# EAGLE design Monlock5x7_buffered (EAGLE 7.2.0)
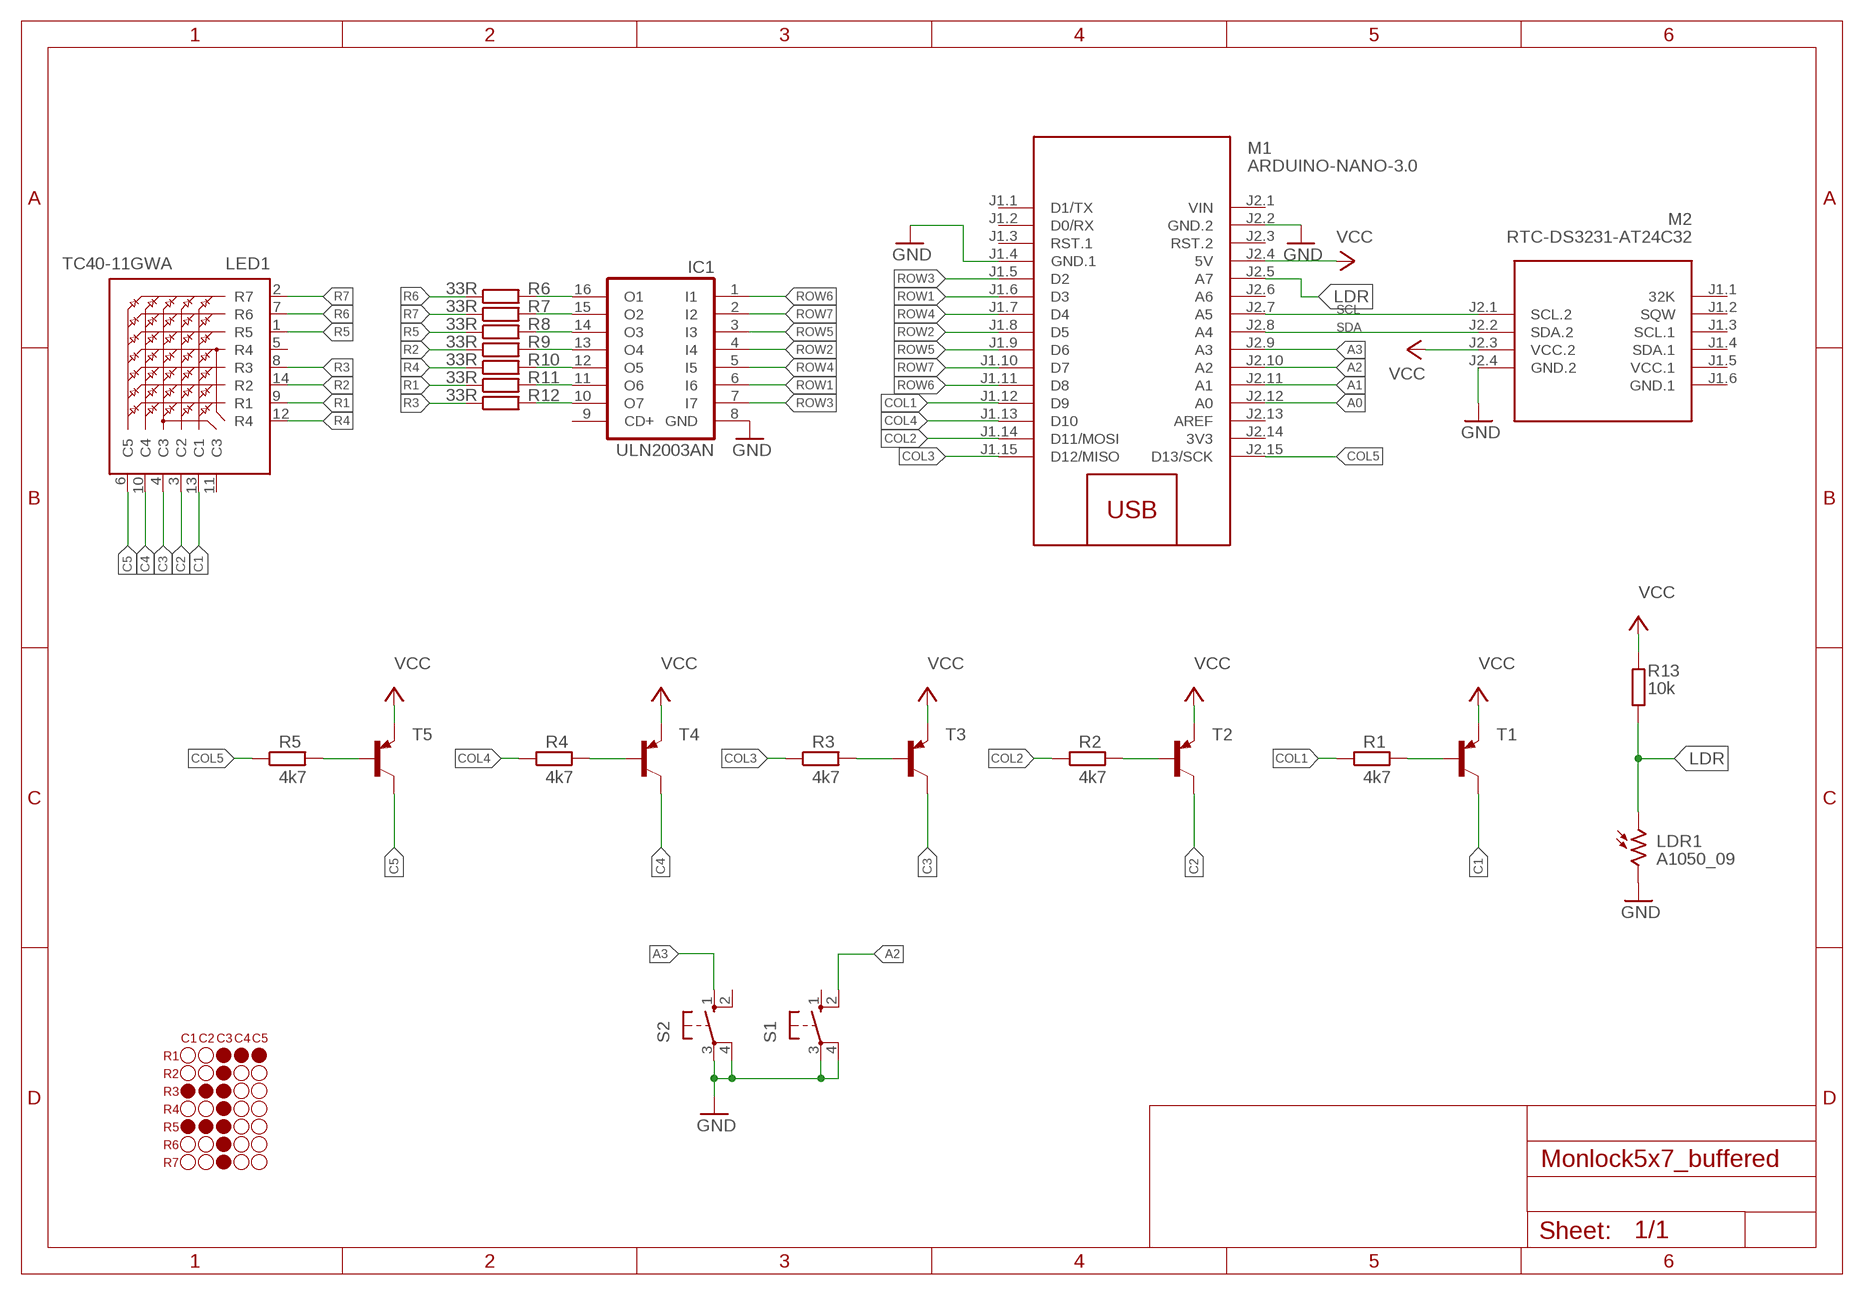
[diagram p0: schematic, sheet 1]

## Parts
IC1  ULN2003AN  [DIL16]
LDR1  A1050_09  [T0-46-A10XX]
LED1  TC40-11GWA  [TC40-11GWA]
M1  ARDUINO-NANO-3.0  [ARDUINO-NANO-3.0]
M2  RTC-DS3231-AT24C32  [RTC-DS3231-AT24C32]
R1  4k7  R-EU_0204/7  [0204/7]
R2  4k7  R-EU_0204/7  [0204/7]
R3  4k7  R-EU_0204/7  [0204/7]
R4  4k7  R-EU_0204/7  [0204/7]
R5  4k7  R-EU_0204/7  [0204/7]
R6  33R  R-EU_0204/7  [0204/7]
R7  33R  R-EU_0204/7  [0204/7]
R8  33R  R-EU_0204/7  [0204/7]
R9  33R  R-EU_0204/7  [0204/7]
R10  33R  R-EU_0204/7  [0204/7]
R11  33R  R-EU_0204/7  [0204/7]
R12  33R  R-EU_0204/7  [0204/7]
R13  10k  R-EU_0204/7  [0204/7]
S1  40-XX  [B3F-40XX]
S2  40-XX  [B3F-40XX]
T1  BC327-PNP-TO92-EBC  [TO92-EBC]
T2  BC327-PNP-TO92-EBC  [TO92-EBC]
T3  BC327-PNP-TO92-EBC  [TO92-EBC]
T4  BC327-PNP-TO92-EBC  [TO92-EBC]
T5  BC327-PNP-TO92-EBC  [TO92-EBC]

## Nets
A0: M1.J2.12(A0)
A1: M1.J2.11(A1)
A2: M1.J2.10(A2) S1.2(S1)
A3: M1.J2.9(A3) S2.1(S)
C1: LED1.13(C1) T1.C
C2: LED1.3(C2) T2.C
C3: LED1.4(C3) T3.C
C4: LED1.10(C4) T4.C
C5: LED1.6(C5) T5.C
CC1: R1.2 T1.B
CC2: R2.2 T2.B
CC3: R3.2 T3.B
CC4: R4.2 T4.B
CC5: R5.2 T5.B
COL1: M1.J1.12(D9) R1.1
COL2: M1.J1.14(D11/MOSI) R2.1
COL3: M1.J1.15(D12/MISO) R3.1
COL4: M1.J1.13(D10) R4.1
COL5: M1.J2.15(D13/SCK) R5.1
GND: IC1.8(GND) LDR1.2 M1.J1.4(GND.1) M1.J2.2(GND.2) M2.J2.4(GND.2) S1.3(P) S1.4(P1) S2.3(P) S2.4(P1)
LDR: LDR1.1 M1.J2.5(A7) R13.1
N$6: IC1.16(O1) R6.2
N$7: IC1.15(O2) R7.2
N$8: IC1.14(O3) R8.2
N$11: IC1.13(O4) R9.2
N$12: IC1.12(O5) R10.2
N$14: IC1.11(O6) R11.2
N$15: IC1.10(O7) R12.2
R1: LED1.9(R1) R11.1
R2: LED1.14(R2) R9.1
R3: LED1.8(R3) R12.1
R4: LED1.12(R4) R10.1
R5: LED1.1(R5) R8.1
R6: LED1.7(R6) R6.1
R7: LED1.2(R7) R7.1
ROW1: IC1.6(I6) M1.J1.6(D3)
ROW2: IC1.4(I4) M1.J1.8(D5)
ROW3: IC1.7(I7) M1.J1.5(D2)
ROW4: IC1.5(I5) M1.J1.7(D4)
ROW5: IC1.3(I3) M1.J1.9(D6)
ROW6: IC1.1(I1) M1.J1.11(D8)
ROW7: IC1.2(I2) M1.J1.10(D7)
SCL: M1.J2.7(A5) M2.J2.1(SCL.2)
SDA: M1.J2.8(A4) M2.J2.2(SDA.2)
VCC: M1.J2.4(5V) M2.J2.3(VCC.2) R13.2 T1.E T2.E T3.E T4.E T5.E
Unconnected: IC1.9(CD+) LED1.5(R4) LED1.11(C3) M1.J1.1(D1/TX) M1.J1.2(D0/RX) M1.J1.3(RST.1) M1.J2.3(RST.2) M1.J2.6(A6) M1.J2.13(AREF) M2.J1.1(32K) M2.J1.2(SQW) M2.J1.3(SCL.1) M2.J1.4(SDA.1) S1.1(S) S2.2(S1)

## Notes on the sheet
- C1 | C2 | C3 | C4 | C5
- R1
- R2
- R3
- R4
- R5
- R6
- R7

## Power pins joined to a net without a drawn wire
3V3: M1.J2.14(3V3)
GND: M2.J1.6(GND.1)
VCC.1: M2.J1.5(VCC.1)
VIN: M1.J2.1(VIN)

## Library data of the parts
IC1 = uln-udn:ULN2003A: DRIVER ARRAY
LDR1 = photo-elements:A10: Sensor Robust Light Sensing Applications Outdoor Light Sensing Application Source: http://optoelectronics.perkinelmer.com/content/Datasheets/DTS_PhotocellsA1050.pdf
LED1 = display-5x7-4inch:TC40-11GWA: 100mm (4.0 INCH) 5x7 DOT MATRIX DISPLAY https://www.kingbrightusa.com/images/catalog/SPEC/TC40-11GWA.pdf; OC_FARNELL: unknown; OC_NEWARK: unknown
M1 = diy-modules:ARDUINO-NANO-3.0: Arduino Nano 3.0 and compatible devices More details available here: https://www.arduino.cc/en/Main/ArduinoBoardNano Click here to find device on ebay.com <http://www.ebay.com/sch/arduino+nano>
M2 = diy-modules:RTC-DS3231-AT24C32: RTC Module with Battery and EEPROM based on DS3231 and AT24C32 chips Tutorial can be found here: https://edwardmallon.wordpress.com/2014/05/21/using-a-cheap-3-ds3231-rtc-at24c32-eeprom-from-ebay/ Click here to find device on ebay.com <http://www.ebay.com/sch/DS3231+AT24C32+module>
R1-R13 = rcl:R-EU_: RESISTOR, European symbol
S1 S2 = switch-omron:40-XX: OMRON SWITCH; MF: OMRON COMPONENTS USA; MPN: B3F-4000; OC_FARNELL: 176434; OC_NEWARK: 36K3105
T1-T5 = transistor:*-PNP-: PNP Transistror

## Board
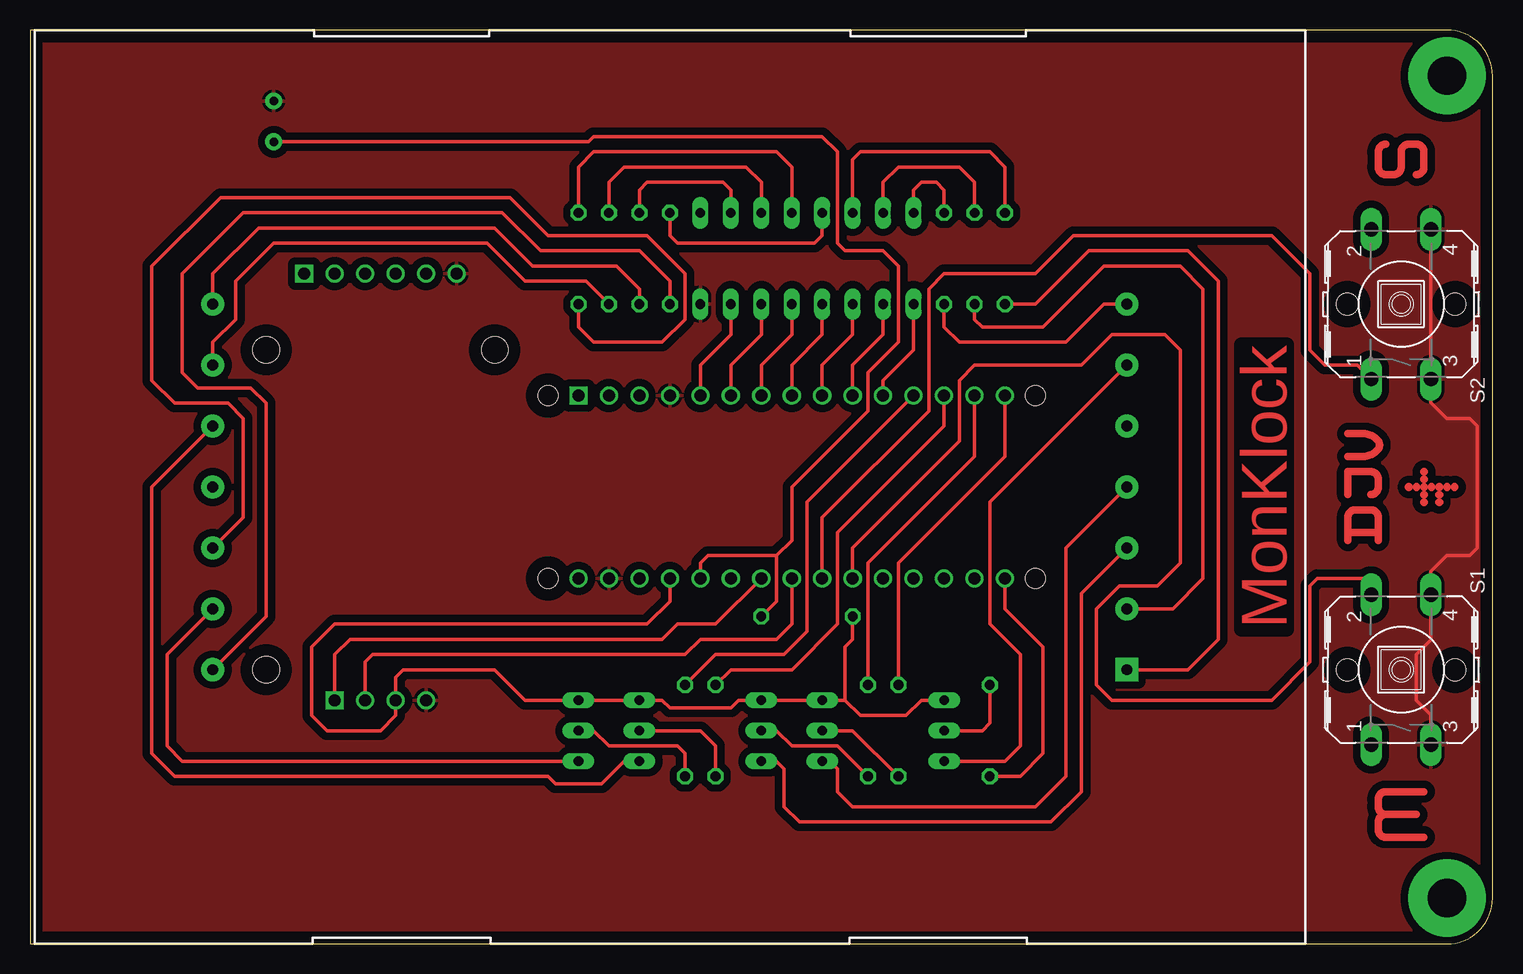
[diagram p1: board, top side]
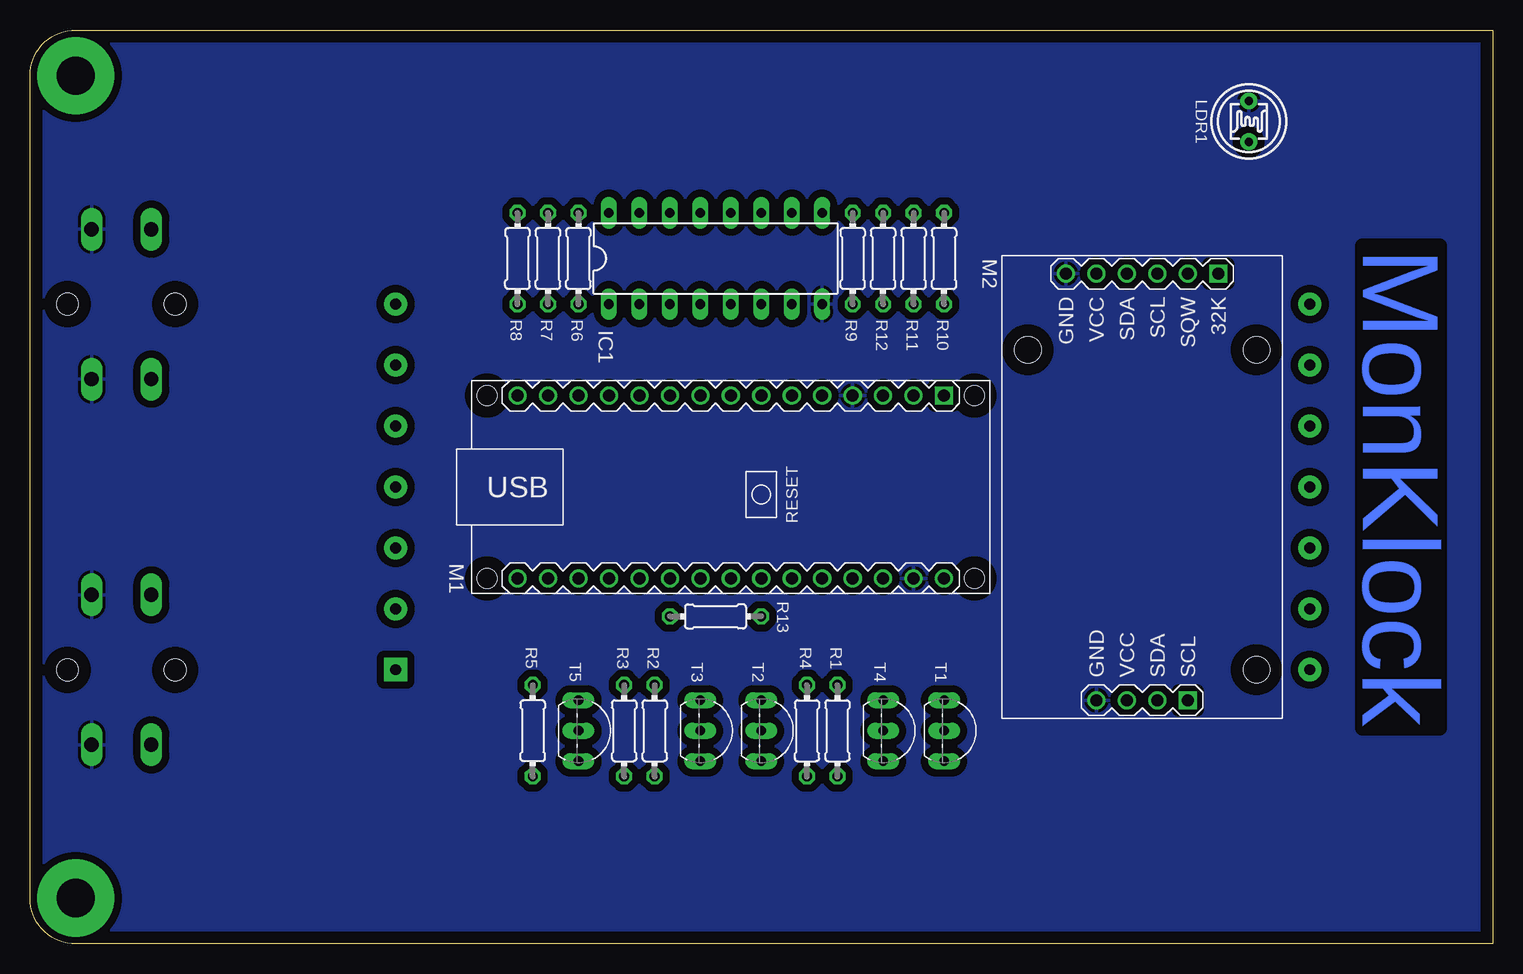
[diagram p2: board, bottom side, seen from below]

Size 121.92 x 76.2 mm. Coordinates in mm from the lower left corner, seen from the top.
Outline: 0,0 118.11,0 arc90 121.92,3.81 121.92,72.39 arc90 118.11,76.2 0,76.2 0,0
Copper layers (1*16): Top 0.035mm / dielectric 1.5mm / Bottom 0.035mm
Design rules "default *": minimum track width 10mil, minimum drill 24mil, track to track 8mil, track to pad 8mil, pad to pad 8mil, via to via 8mil, smd to smd 8mil, copper to edge 40mil, drill to drill 8mil, minimum pad ring 10mil, minimum via ring 8mil, stop-mask expansion 4mil, vias tented up to drill 0mil, thermal gap 10mil

### Footprints (pad centres in the part's own frame; a part is rotated, then mirrored left to right if it is on the bottom)
DIL16 = drill 0.813 long: 1 -8.89,-3.81; 2 -6.35,-3.81; 3 -3.81,-3.81; 4 -1.27,-3.81; 5 1.27,-3.81; 6 3.81,-3.81; 7 6.35,-3.81; 8 8.89,-3.81; 9 8.89,3.81; 10 6.35,3.81; 11 3.81,3.81; 12 1.27,3.81; 13 -1.27,3.81; 14 -3.81,3.81; 15 -6.35,3.81; 16 -8.89,3.81
T0-46-A10XX = drill 0.7 pad 1.4: 1 -1.7,0; 2 1.7,0
TC40-11GWA = drill 0.9 pad 1.93 square: 1 -15.24,-38.1 | drill 0.9 pad 1.93: 2 -10.16,-38.1; 3 -5.08,-38.1; 4 0,-38.1; 5 5.08,-38.1; 6 10.16,-38.1; 7 15.24,-38.1; 8 15.24,38.1; 9 10.16,38.1; 10 5.08,38.1; 11 0,38.1; 12 -5.08,38.1; 13 -10.16,38.1; 14 -15.24,38.1
ARDUINO-NANO-3.0 = drill 1 square: J1.1 17.78,7.62 | drill 1: J1.2 15.24,7.62; J1.3 12.7,7.62; J1.4 10.16,7.62; J1.5 7.62,7.62; J1.6 5.08,7.62; J1.7 2.54,7.62; J1.8 0,7.62; J1.9 -2.54,7.62; J1.10 -5.08,7.62; J1.11 -7.62,7.62; J1.12 -10.16,7.62; J1.13 -12.7,7.62; J1.14 -15.24,7.62; J1.15 -17.78,7.62; J2.1 17.78,-7.62; J2.2 15.24,-7.62; J2.3 12.7,-7.62; J2.4 10.16,-7.62; J2.5 7.62,-7.62; J2.6 5.08,-7.62; J2.7 2.54,-7.62; J2.8 0,-7.62; J2.9 -2.54,-7.62; J2.10 -5.08,-7.62; J2.11 -7.62,-7.62; J2.12 -10.16,-7.62; J2.13 -12.7,-7.62; J2.14 -15.24,-7.62; J2.15 -17.78,-7.62 | hole 1.651: -20.32,7.62; -20.32,-7.62; 20.32,-7.62; 20.32,7.62
RTC-DS3231-AT24C32 = drill 1 square: J1.1 -17.78,6.35; J2.1 17.78,3.81 | drill 1: J1.2 -17.78,3.81; J1.3 -17.78,1.27; J1.4 -17.78,-1.27; J1.5 -17.78,-3.81; J1.6 -17.78,-6.35; J2.2 17.78,1.27; J2.3 17.78,-1.27; J2.4 17.78,-3.81 | hole 2.2: -11.43,-9.525; -11.43,9.525; 15.24,9.525
0204/7 = drill 0.813 octagon: 1 -3.81,0; 2 3.81,0
B3F-40XX = drill 1.194 long: 1 -6.248,2.489; 2 6.248,2.489; 3 -6.248,-2.489; 4 6.248,-2.489 | hole 1.803: 0,-4.496; 0,4.496
TO92-EBC = drill 0.813 long: B 0,-1.27; C 2.54,-1.27; E -2.54,-1.27

### Placement (x,y rotation side)
IC1  64.77,57.15 0 bottom
LDR1  20.32,68.58 90 bottom
LED1  53.34,38.1 90 top
M1  63.5,38.1 0 bottom
M2  29.21,38.1 270 bottom
R1  54.61,17.78 270 bottom
R2  69.85,17.78 270 bottom
R3  72.39,17.78 270 bottom
R4  57.15,17.78 270 bottom
R5  80.01,17.78 90 bottom
R6  76.2,57.15 90 bottom
R7  78.74,57.15 90 bottom
R8  81.28,57.15 90 bottom
R9  53.34,57.15 90 bottom
R10  45.72,57.15 90 bottom
R11  48.26,57.15 90 bottom
R12  50.8,57.15 90 bottom
R13  64.77,27.3 180 bottom
S1  114.3,22.86 90 top
S2  114.3,53.34 90 top
T1  44.45,17.78 270 bottom
T2  59.69,17.78 270 bottom
T3  64.77,17.78 270 bottom
T4  49.53,17.78 270 bottom
T5  74.93,17.78 270 bottom

### Tracks (layer width: path | path; a pad name or v marks a point on that pad's centre or on a via)
A2
  Top 0.305: M1.J2.10 68.58,33.02 77.47,41.91 77.47,46.99 78.74,48.26 87.63,48.26 90.17,50.8 94.61,50.8 95.88,49.53 95.88,31.75 93.98,29.84 90.8,29.84 88.9,27.94 88.9,21.59 90.17,20.32 103.5,20.32 106.68,23.5 106.68,29.84 107.31,30.48 111.12,30.48 111.81,29.79 S1.2
A3
  Top 0.305: M1.J2.9 66.04,35.56 74.93,44.45 74.93,54.61 76.2,55.88 83.82,55.88 86.99,59.05 103.5,59.05 106.68,55.88 106.68,49.53 107.95,48.26 110.64,48.26 S2.1
C1
  Top 0.305: LED1.13 11.43,24.13 11.43,16.51 12.7,15.24 T1.C
C2
  Top 0.305: T2.C 62.23,15.24 62.87,14.61 62.87,11.43 64.14,10.16 85.09,10.16 87.63,12.7 87.63,29.21 LED1.3
C3
  Top 0.305: LED1.4 86.36,33.02 86.36,13.97 83.82,11.43 69.85,11.43 68.58,11.43 67.31,12.7 67.31,14.61 66.67,15.24 T3.C
C4
  Top 0.305: T4.C 49.53,15.24 47.62,13.34 43.81,13.34 43.18,13.97 12.07,13.97 10.16,15.88 10.16,38.1 LED1.10
C5
  Top 0.305: LED1.6 80.01,36.83 80.01,26.67 82.55,24.13 82.55,16.51 81.28,15.24 T5.C
CC1
  Top 0.305: T1.B 46.99,17.78 48.26,16.51 53.98,16.51 54.61,15.88 R1.2
CC2
  Top 0.305: T2.B 62.23,17.78 63.5,16.51 67.31,16.51 R2.2
CC3
  Top 0.305: T3.B 68.58,17.78 R3.2
CC4
  Top 0.305: T4.B 55.88,17.78 57.15,16.51 R4.2
CC5
  Top 0.305: T5.B 79.38,17.78 80.01,18.41 R5.2
COL1
  Top 0.305: M1.J1.12 64.77,36.83 64.77,26.04 62.87,24.13 57.15,24.13 R1.1
COL2
  Top 0.305: R2.1 69.85,31.75 78.74,40.64 M1.J1.14
COL3
  Top 0.305: R3.1 72.39,31.75 81.28,40.64 M1.J1.15
COL4
  Top 0.305: M1.J1.13 76.2,43.18 67.31,34.29 67.31,26.67 63.5,22.86 58.42,22.86 R4.1
COL5
  Top 0.305: M1.J2.15 81.28,27.94 83.82,25.4 84.45,24.77 84.45,15.88 82.55,13.97 R5.1
GND
  Top 0.305: S1.3 116.79,19.1 115.57,20.32 115.57,24.13 116.79,25.35 S1.4 116.79,31.06 118.11,32.38 120.02,32.38 120.65,33.02 120.65,43.18 120.02,43.81 118.11,43.81 116.79,45.14 S2.3 S2.4
  pour Top (isolate 0.61): 0,0 0,76.2 122.55,76.2 122.55,0
  pour Bottom (isolate 0.61): 0,0 0,76.2 121.92,76.2 121.92,0
LDR
  Top 0.305: R13.1 62.23,28.57 62.23,32.38 | 62.23,32.38 56.52,32.38 55.88,31.75 M1.J2.5 | 62.23,32.38 63.5,33.66 63.5,38.1 69.85,44.45 69.85,47.62 72.39,50.16 72.39,56.52 71.12,57.78 67.94,57.78 67.31,58.42 67.31,66.04 66.04,67.31 46.99,67.31 46.56,66.88 LDR1.1
N$1  (via drill 3.2 pad 6.45)
  other vias: 118.11,72.39
N$2  (via drill 3.2 pad 6.45)
  other vias: 118.11,3.81
N$3
  Top 0.61: 113.03,66.67 arc90 112.39,66.04 112.39,64.77 arc90 113.03,64.14 113.66,64.14 arc90 114.3,64.77 114.3,66.04 arc-90 114.93,66.67 115.57,66.67 arc-90 116.2,66.04 116.2,64.77 arc-90 115.57,64.14
N$6
  Top 0.305: R6.2 76.2,62.87 75.56,63.5 74.3,63.5 73.66,62.87 IC1.16
N$7
  Top 0.305: R7.2 78.74,63.5 77.47,64.77 72.39,64.77 71.12,63.5 IC1.15
N$8
  Top 0.305: R8.2 81.28,64.77 80.01,66.04 69.22,66.04 68.58,65.41 IC1.14
N$11
  Top 0.305: IC1.13 66.04,59.05 65.41,58.42 53.98,58.42 53.34,59.05 R9.2
N$12
  Top 0.305: R10.2 45.72,64.77 46.99,66.04 62.23,66.04 63.5,64.77 IC1.12
N$13
  Top 0.61: 116.2,8.89 113.03,8.89 arc-90 112.39,9.53 112.39,10.16 arc-90 113.03,10.79 | 116.2,12.7 113.03,12.7 arc90 112.39,12.06 112.39,11.43 arc90 113.03,10.79 | 113.03,10.79 115.57,10.79
N$14
  Top 0.305: R11.2 48.26,63.5 49.53,64.77 59.69,64.77 60.96,63.5 IC1.11
N$15
  Top 0.305: R12.2 50.8,62.87 51.44,63.5 57.79,63.5 58.42,62.87 IC1.10
N$17
  Top 0.61: 109.85,33.66 109.85,34.29 | 109.85,34.29 109.85,35.56 arc-90 110.49,36.2 111.76,36.2 arc-90 112.39,35.56 112.39,34.29 | 112.39,34.29 112.39,33.66 | 109.85,34.29 112.39,34.29
N$18
  Top 0.61: 109.85,37.47 109.85,39.37 111.76,39.37 arc-90 112.39,38.73 112.39,38.1 arc-90 111.76,37.47
N$19
  Top 0.61: 109.85,42.55 111.12,42.55 arc-53 112.39,41.91 arc-74 112.39,41.27 arc-53 111.12,40.64 109.85,40.64
R1
  Top 0.305: LED1.9 15.24,50.16 17.14,52.07 17.14,55.24 20.32,58.42 38.1,58.42 41.27,55.24 46.35,55.24 R11.1
R2
  Top 0.305: LED1.14 19.69,27.3 19.69,45.09 18.41,46.35 13.97,46.35 12.7,47.62 12.7,55.88 17.78,60.96 39.37,60.96 42.55,57.78 50.8,57.78 53.34,55.24 R9.1
R3
  Top 0.305: LED1.8 15.24,55.88 19.05,59.69 38.73,59.69 41.91,56.52 48.9,56.52 50.8,54.61 R12.1
R4
  Top 0.305: LED1.12 17.78,35.56 17.78,43.81 16.51,45.09 12.07,45.09 10.16,46.99 10.16,56.52 15.88,62.23 40.01,62.23 43.18,59.05 51.44,59.05 54.61,55.88 54.61,52.07 52.71,50.16 46.99,50.16 45.72,51.44 R10.1
R5
  Top 0.305: LED1.1 96.52,22.86 99.06,25.4 99.06,55.24 96.52,57.78 88.27,57.78 83.82,53.34 R8.1
R6
  Top 0.305: R6.1 76.2,51.44 77.47,50.16 86.36,50.16 89.53,53.34 LED1.7
R7
  Top 0.305: LED1.2 93.98,27.94 95.25,27.94 97.79,30.48 97.79,31.75 97.79,54.61 95.88,56.52 89.53,56.52 84.45,51.44 79.38,51.44 78.74,52.07 R7.1
ROW1
  Top 0.305: IC1.6 60.96,50.8 58.42,48.26 M1.J1.6
ROW2
  Top 0.305: IC1.4 66.04,50.8 63.5,48.26 M1.J1.8
ROW3
  Top 0.305: IC1.7 58.42,50.8 55.88,48.26 M1.J1.5
ROW4
  Top 0.305: IC1.5 63.5,50.8 60.96,48.26 M1.J1.7
ROW5
  Top 0.305: IC1.3 68.58,50.8 66.04,48.26 M1.J1.9
ROW6
  Top 0.305: IC1.1 73.66,49.53 71.12,46.99 M1.J1.11
ROW7
  Top 0.305: IC1.2 71.12,50.8 68.58,48.26 M1.J1.10
SCL
  Top 0.305: M2.J2.1 25.4,24.13 26.67,25.4 52.71,25.4 53.98,26.67 57.15,26.67 M1.J2.7
SDA
  Top 0.305: M2.J2.2 27.94,23.5 28.58,24.13 54.61,24.13 55.88,25.4 62.23,25.4 63.5,26.67 M1.J2.8
VCC
  Top 0.305: 67.94,20.32 69.22,19.05 73.02,19.05 74.3,20.32 T5.E | 67.94,20.32 T3.E T2.E 59.05,20.32 58.42,19.68 53.34,19.68 52.71,20.32 T4.E T1.E 41.27,20.32 38.73,22.86 31.12,22.86 30.48,22.23 M2.J2.3 30.48,19.05 29.21,17.78 24.77,17.78 23.5,19.05 23.5,24.77 25.4,26.67 51.44,26.67 53.34,28.57 M1.J2.4 | R13.2 68.58,25.4 67.94,24.77 67.94,20.32
(copper drawn outside any net)
  shapes: Top circle x13

### Text on the board
Top: MonKlock
Bottom: MonKlock
tStop: MonKlock
bStop: MonKlock